# EAGLE design robot_vr (EAGLE 7.6.0)
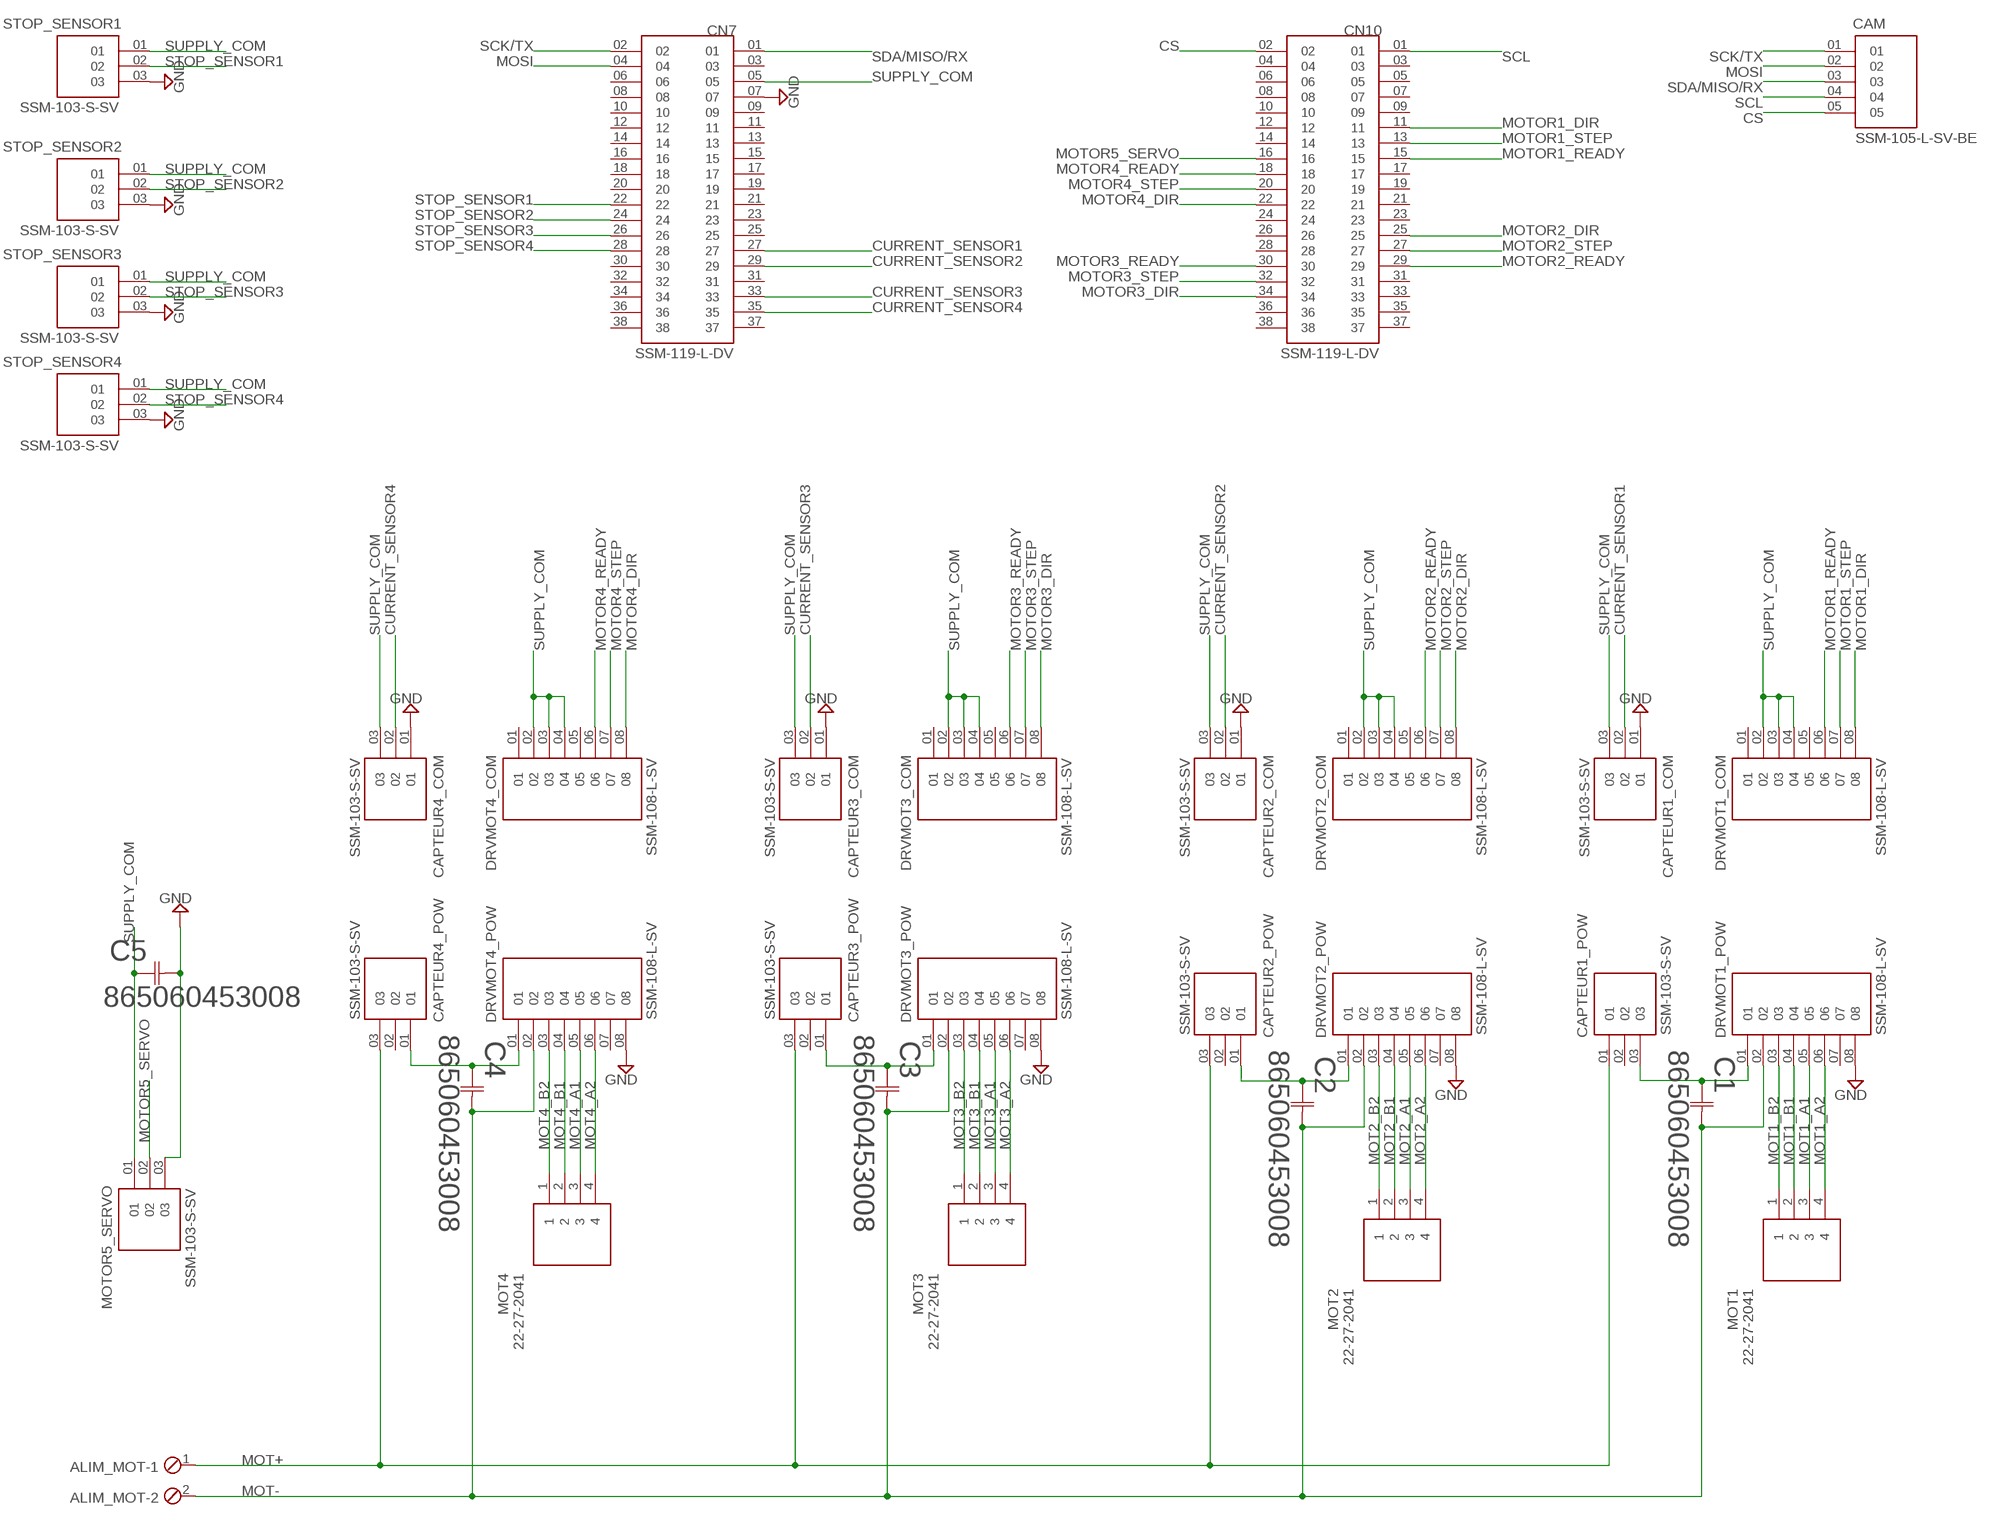
[diagram p0: schematic, sheet 1]

## Parts
ALIM_MOT  MPT2  [2POL254]
C1  865060453008  [CAP_865060453008_WRE]
C2  865060453008  [CAP_865060453008_WRE]
C3  865060453008  [CAP_865060453008_WRE]
C4  865060453008  [CAP_865060453008_WRE]
C5  865060453008  [CAP_865060453008_WRE]
CAM  SSM-105-L-SV-BE  [SAMTEC_SSM-105-L-SV-BE]
CAPTEUR1_COM  SSM-103-S-SV  [SAMTEC_SSM-103-S-SV]
CAPTEUR1_POW  SSM-103-S-SV  [SAMTEC_SSM-103-S-SV]
CAPTEUR2_COM  SSM-103-S-SV  [SAMTEC_SSM-103-S-SV]
CAPTEUR2_POW  SSM-103-S-SV  [SAMTEC_SSM-103-S-SV]
CAPTEUR3_COM  SSM-103-S-SV  [SAMTEC_SSM-103-S-SV]
CAPTEUR3_POW  SSM-103-S-SV  [SAMTEC_SSM-103-S-SV]
CAPTEUR4_COM  SSM-103-S-SV  [SAMTEC_SSM-103-S-SV]
CAPTEUR4_POW  SSM-103-S-SV  [SAMTEC_SSM-103-S-SV]
CN7  SSM-119-L-DV  [SAMTEC_SSM-119-L-DV]
CN10  SSM-119-L-DV  [SAMTEC_SSM-119-L-DV]
DRVMOT1_COM  SSM-108-L-SV  [SAMTEC_SSM-108-L-SV]
DRVMOT1_POW  SSM-108-L-SV  [SAMTEC_SSM-108-L-SV]
DRVMOT2_COM  SSM-108-L-SV  [SAMTEC_SSM-108-L-SV]
DRVMOT2_POW  SSM-108-L-SV  [SAMTEC_SSM-108-L-SV]
DRVMOT3_COM  SSM-108-L-SV  [SAMTEC_SSM-108-L-SV]
DRVMOT3_POW  SSM-108-L-SV  [SAMTEC_SSM-108-L-SV]
DRVMOT4_COM  SSM-108-L-SV  [SAMTEC_SSM-108-L-SV]
DRVMOT4_POW  SSM-108-L-SV  [SAMTEC_SSM-108-L-SV]
MOT1  22-27-2041  [HDRV4W64P254_100_4X1_1016X580H]
MOT2  22-27-2041  [HDRV4W64P254_100_4X1_1016X580H]
MOT3  22-27-2041  [HDRV4W64P254_100_4X1_1016X580H]
MOT4  22-27-2041  [HDRV4W64P254_100_4X1_1016X580H]
MOTOR5_SERVO  SSM-103-S-SV  [SAMTEC_SSM-103-S-SV]
STOP_SENSOR1  SSM-103-S-SV  [SAMTEC_SSM-103-S-SV]
STOP_SENSOR2  SSM-103-S-SV  [SAMTEC_SSM-103-S-SV]
STOP_SENSOR3  SSM-103-S-SV  [SAMTEC_SSM-103-S-SV]
STOP_SENSOR4  SSM-103-S-SV  [SAMTEC_SSM-103-S-SV]

## Nets
CAPTEUR_MOT1: C1.1 CAPTEUR1_POW.03 DRVMOT1_POW.01
CAPTEUR_MOT2: C2.1 CAPTEUR2_POW.01 DRVMOT2_POW.01
CAPTEUR_MOT3: C3.1 CAPTEUR3_POW.01 DRVMOT3_POW.01
CAPTEUR_MOT4: C4.1 CAPTEUR4_POW.01 DRVMOT4_POW.01
CS: CAM.05 CN10.02
CURRENT_SENSOR1: CAPTEUR1_COM.02 CN7.27
CURRENT_SENSOR2: CAPTEUR2_COM.02 CN7.29
CURRENT_SENSOR3: CAPTEUR3_COM.02 CN7.33
CURRENT_SENSOR4: CAPTEUR4_COM.02 CN7.35
GND: C5.2 CAPTEUR1_COM.01 CAPTEUR2_COM.01 CAPTEUR3_COM.01 CAPTEUR4_COM.01 CN7.07 DRVMOT1_POW.08 DRVMOT2_POW.08 DRVMOT3_POW.08 DRVMOT4_POW.08 MOTOR5_SERVO.03 STOP_SENSOR1.03 STOP_SENSOR2.03 STOP_SENSOR3.03 STOP_SENSOR4.03
MOSI: CAM.02 CN7.04
MOT1_A1: DRVMOT1_POW.05 MOT1.3
MOT1_A2: DRVMOT1_POW.06 MOT1.4
MOT1_B1: DRVMOT1_POW.04 MOT1.2
MOT1_B2: DRVMOT1_POW.03 MOT1.1
MOT2_A1: DRVMOT2_POW.05 MOT2.3
MOT2_A2: DRVMOT2_POW.06 MOT2.4
MOT2_B1: DRVMOT2_POW.04 MOT2.2
MOT2_B2: DRVMOT2_POW.03 MOT2.1
MOT3_A1: DRVMOT3_POW.05 MOT3.3
MOT3_A2: DRVMOT3_POW.06 MOT3.4
MOT3_B1: DRVMOT3_POW.04 MOT3.2
MOT3_B2: DRVMOT3_POW.03 MOT3.1
MOT4_A1: DRVMOT4_POW.05 MOT4.3
MOT4_A2: DRVMOT4_POW.06 MOT4.4
MOT4_B1: DRVMOT4_POW.04 MOT4.2
MOT4_B2: DRVMOT4_POW.03 MOT4.1
MOT+: ALIM_MOT.1 CAPTEUR1_POW.01 CAPTEUR2_POW.03 CAPTEUR3_POW.03 CAPTEUR4_POW.03
MOT-: ALIM_MOT.2 C1.2 C2.2 C3.2 C4.2 DRVMOT1_POW.02 DRVMOT2_POW.02 DRVMOT3_POW.02 DRVMOT4_POW.02
MOTOR1_DIR: CN10.11 DRVMOT1_COM.08
MOTOR1_READY: CN10.15 DRVMOT1_COM.06
MOTOR1_STEP: CN10.13 DRVMOT1_COM.07
MOTOR2_DIR: CN10.25 DRVMOT2_COM.08
MOTOR2_READY: CN10.29 DRVMOT2_COM.06
MOTOR2_STEP: CN10.27 DRVMOT2_COM.07
MOTOR3_DIR: CN10.34 DRVMOT3_COM.08
MOTOR3_READY: CN10.30 DRVMOT3_COM.06
MOTOR3_STEP: CN10.32 DRVMOT3_COM.07
MOTOR4_DIR: CN10.22 DRVMOT4_COM.08
MOTOR4_READY: CN10.18 DRVMOT4_COM.06
MOTOR4_STEP: CN10.20 DRVMOT4_COM.07
MOTOR5_SERVO: CN10.16 MOTOR5_SERVO.02
SCK/TX: CAM.01 CN7.02
SCL: CAM.04 CN10.01
SDA/MISO/RX: CAM.03 CN7.01
STOP_SENSOR1: CN7.22 STOP_SENSOR1.02
STOP_SENSOR2: CN7.24 STOP_SENSOR2.02
STOP_SENSOR3: CN7.26 STOP_SENSOR3.02
STOP_SENSOR4: CN7.28 STOP_SENSOR4.02
SUPPLY_COM: C5.1 CAPTEUR1_COM.03 CAPTEUR2_COM.03 CAPTEUR3_COM.03 CAPTEUR4_COM.03 CN7.05 DRVMOT1_COM.02 DRVMOT1_COM.03 DRVMOT1_COM.04 DRVMOT2_COM.02 DRVMOT2_COM.03 DRVMOT2_COM.04 DRVMOT3_COM.02 DRVMOT3_COM.03 DRVMOT3_COM.04 DRVMOT4_COM.02 DRVMOT4_COM.03 DRVMOT4_COM.04 MOTOR5_SERVO.01 STOP_SENSOR1.01 STOP_SENSOR2.01 STOP_SENSOR3.01 STOP_SENSOR4.01
Unconnected: CAPTEUR1_POW.02 CAPTEUR2_POW.02 CAPTEUR3_POW.02 CAPTEUR4_POW.02 CN7.03 CN7.06 CN7.08 CN7.09 CN7.10 CN7.11 CN7.12 CN7.13 CN7.14 CN7.15 CN7.16 CN7.17 CN7.18 CN7.19 CN7.20 CN7.21 CN7.23 CN7.25 CN7.30 CN7.31 CN7.32 CN7.34 CN7.36 CN7.37 CN7.38 CN10.03 CN10.04 CN10.05 CN10.06 CN10.07 CN10.08 CN10.09 CN10.10 CN10.12 CN10.14 CN10.17 CN10.19 CN10.21 CN10.23 CN10.24 CN10.26 CN10.28 CN10.31 CN10.33 CN10.35 CN10.36 CN10.37 CN10.38 DRVMOT1_COM.01 DRVMOT1_COM.05 DRVMOT1_POW.07 DRVMOT2_COM.01 DRVMOT2_COM.05 DRVMOT2_POW.07 DRVMOT3_COM.01 DRVMOT3_COM.05 DRVMOT3_POW.07 DRVMOT4_COM.01 DRVMOT4_COM.05 DRVMOT4_POW.07

## Library data of the parts
ALIM_MOT = con-phoenix-254:MPT2: PHOENIX CONNECTOR; OC_FARNELL: unknown; OC_NEWARK: unknown
C1-C5 = Condo-Wurth:865060453008; COPYRIGHT: Copyright (C) 2022 Ultra Librarian. All rights reserved.; MANUFACTURER_PART_NUMBER: 865060453008; MFR_NAME: Wurth Electronics
CAM = SSM-105-L-SV-BE:SSM-105-L-SV-BE: Check prices <https://pricing.snapeda.com/parts/SSM-105-L-SV-BE-TR/Samtec/view-part?ref=eda>; AVAILABILITY: In Stock; DESCRIPTION: 5 Position Receptacle, Bottom Entry Connector 0.100 (2.54mm) Surface Mount Gold; MF: Samtec; MP: SSM-105-L-SV-BE-TR; PACKAGE: None; PRICE: None; PURCHASE-URL: https://pricing.snapeda.com/search/part/SSM-105-L-SV-BE-TR/?ref=eda
CAPTEUR1_COM CAPTEUR1_POW CAPTEUR2_COM CAPTEUR2_POW CAPTEUR3_COM CAPTEUR3_POW CAPTEUR4_COM CAPTEUR4_POW MOTOR5_SERVO STOP_SENSOR1-STOP_SENSOR4 = SSM-103-S-SV:SSM-103-S-SV: Check prices <https://pricing.snapeda.com/parts/SSM-103-S-SV/Samtec/view-part?ref=eda>; AVAILABILITY: In Stock; DESCRIPTION: 3 Position Receptacle, Bottom Entry Connector 0.100 (2.54mm) Surface Mount Gold; MF: Samtec; MP: SSM-103-S-SV; PACKAGE: None; PRICE: None; PURCHASE-URL: https://pricing.snapeda.com/search/part/SSM-103-S-SV/?ref=eda
CN7 CN10 = SSM-119-L-DV:SSM-119-L-DV: Check prices <https://pricing.snapeda.com/parts/SSM-119-L-DV/Samtec%20Inc./view-part?ref=eda>; AVAILABILITY: In Stock; DESCRIPTION: 38 Position Receptacle, Pass Through Connector 0.100 (2.54mm) Surface Mount Gold; MF: Samtec Inc.; MP: SSM-119-L-DV; PACKAGE: None; PRICE: None; PURCHASE-URL: https://pricing.snapeda.com/search/part/SSM-119-L-DV/?ref=eda
DRVMOT1_COM DRVMOT1_POW DRVMOT2_COM DRVMOT2_POW DRVMOT3_COM DRVMOT3_POW DRVMOT4_COM DRVMOT4_POW = SSM-108-L-SV:SSM-108-L-SV: Check prices <https://pricing.snapeda.com/parts/SSM-108-L-SV/Samtec/view-part?ref=eda>; AVAILABILITY: In Stock; DESCRIPTION: 8 Position Receptacle, Pass Through Connector 0.100 (2.54mm) Surface Mount Gold; MF: Samtec; MP: SSM-108-L-SV; PACKAGE: None; PRICE: None; PURCHASE-URL: https://pricing.snapeda.com/search/part/SSM-108-L-SV/?ref=eda
MOT1-MOT4 = 22-27-2041:22-27-2041: Molex 22-27-2041 second source Source: Datasheet; DESCRIPTION: Molex 22-27-2041 second source; HEIGHT: mm; MANUFACTURER_NAME: Bloggs Bits; MANUFACTURER_PART_NUMBER: 22-27-2041

## Board
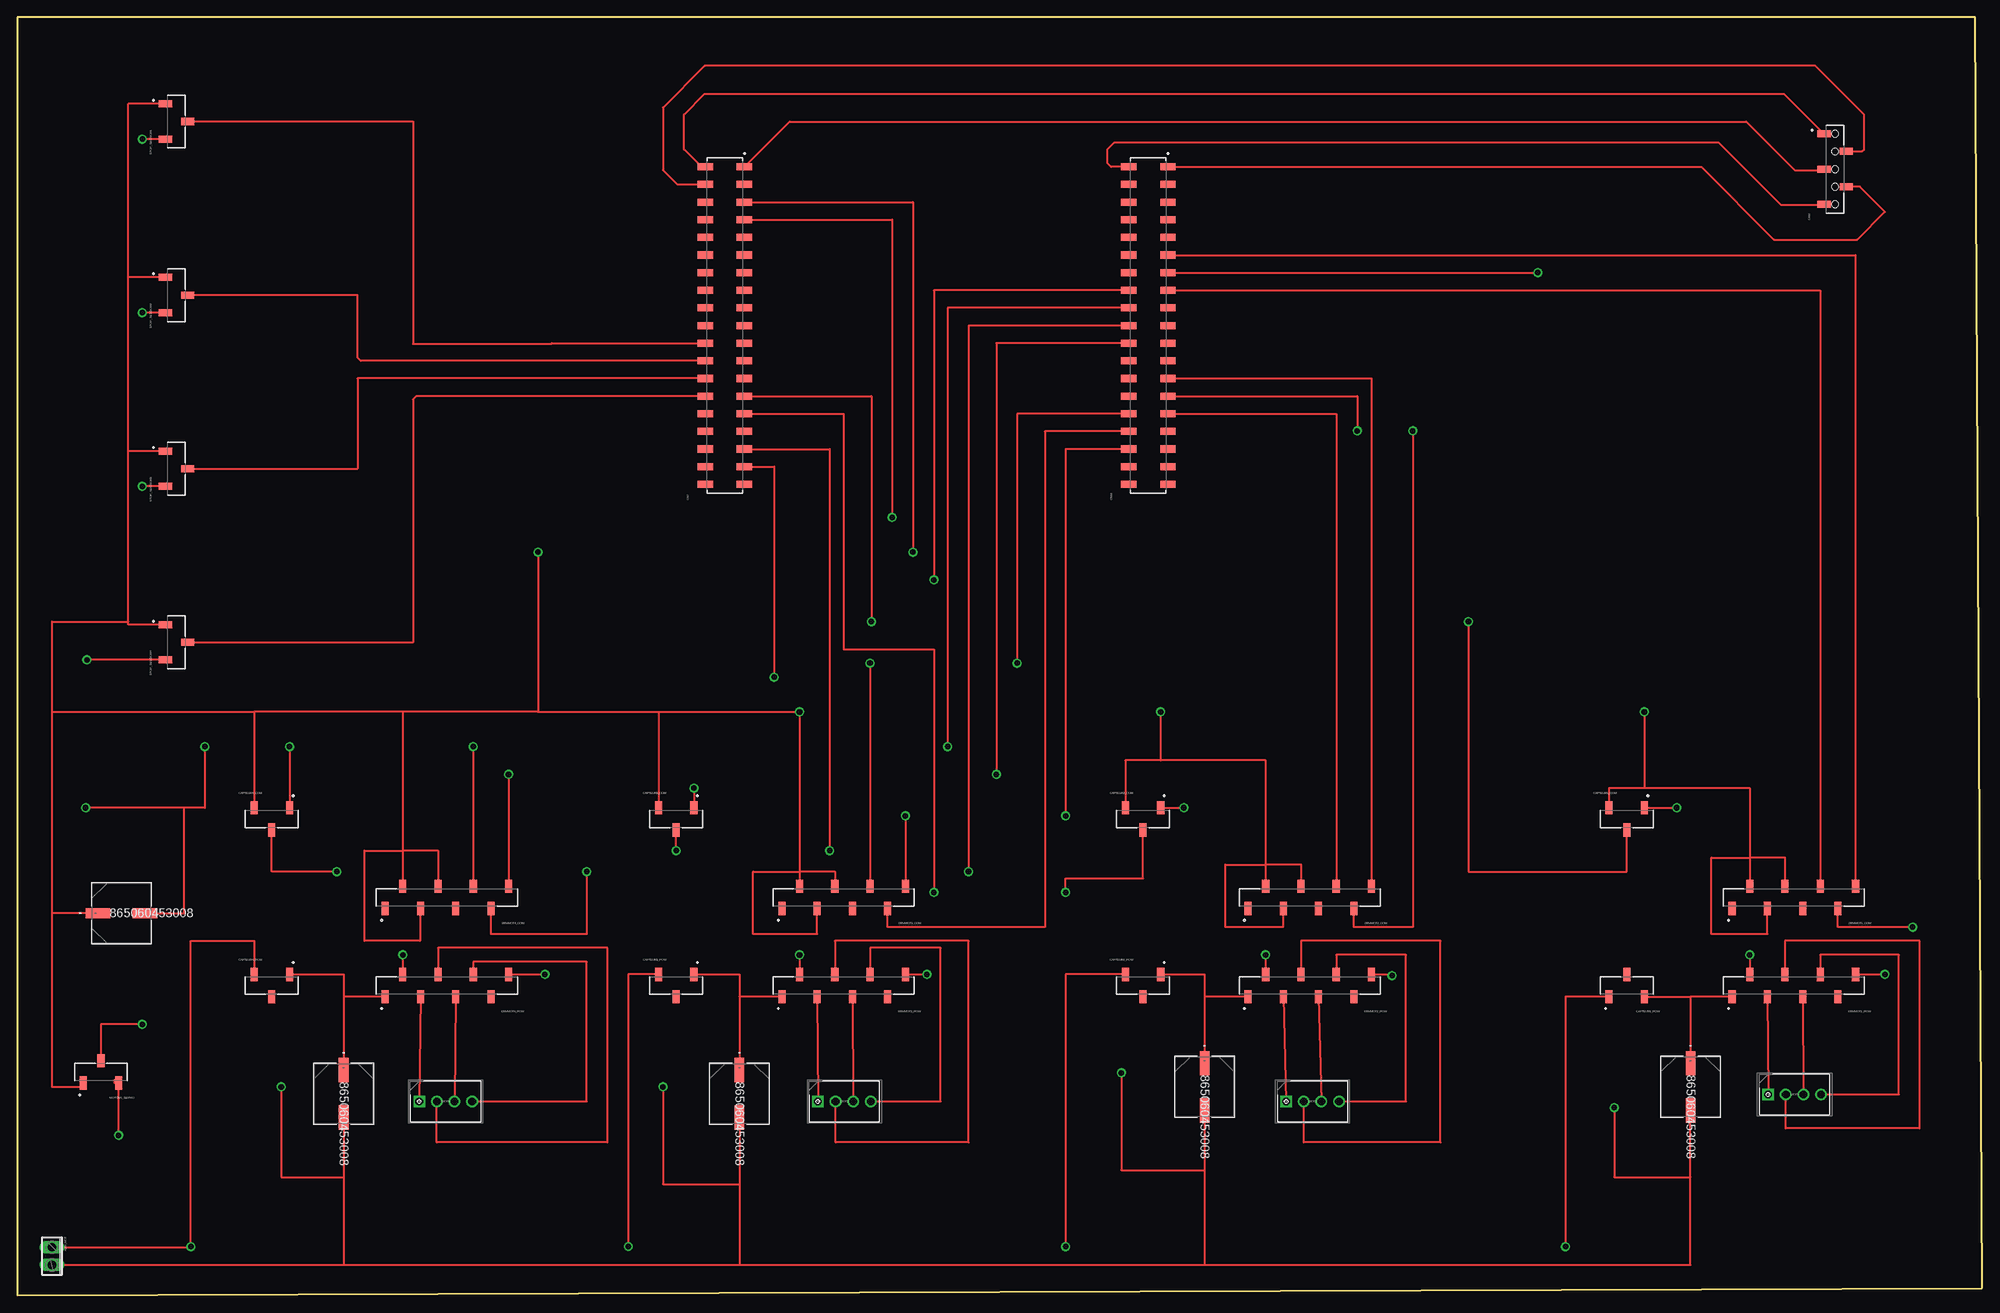
[diagram p1: board, top side]
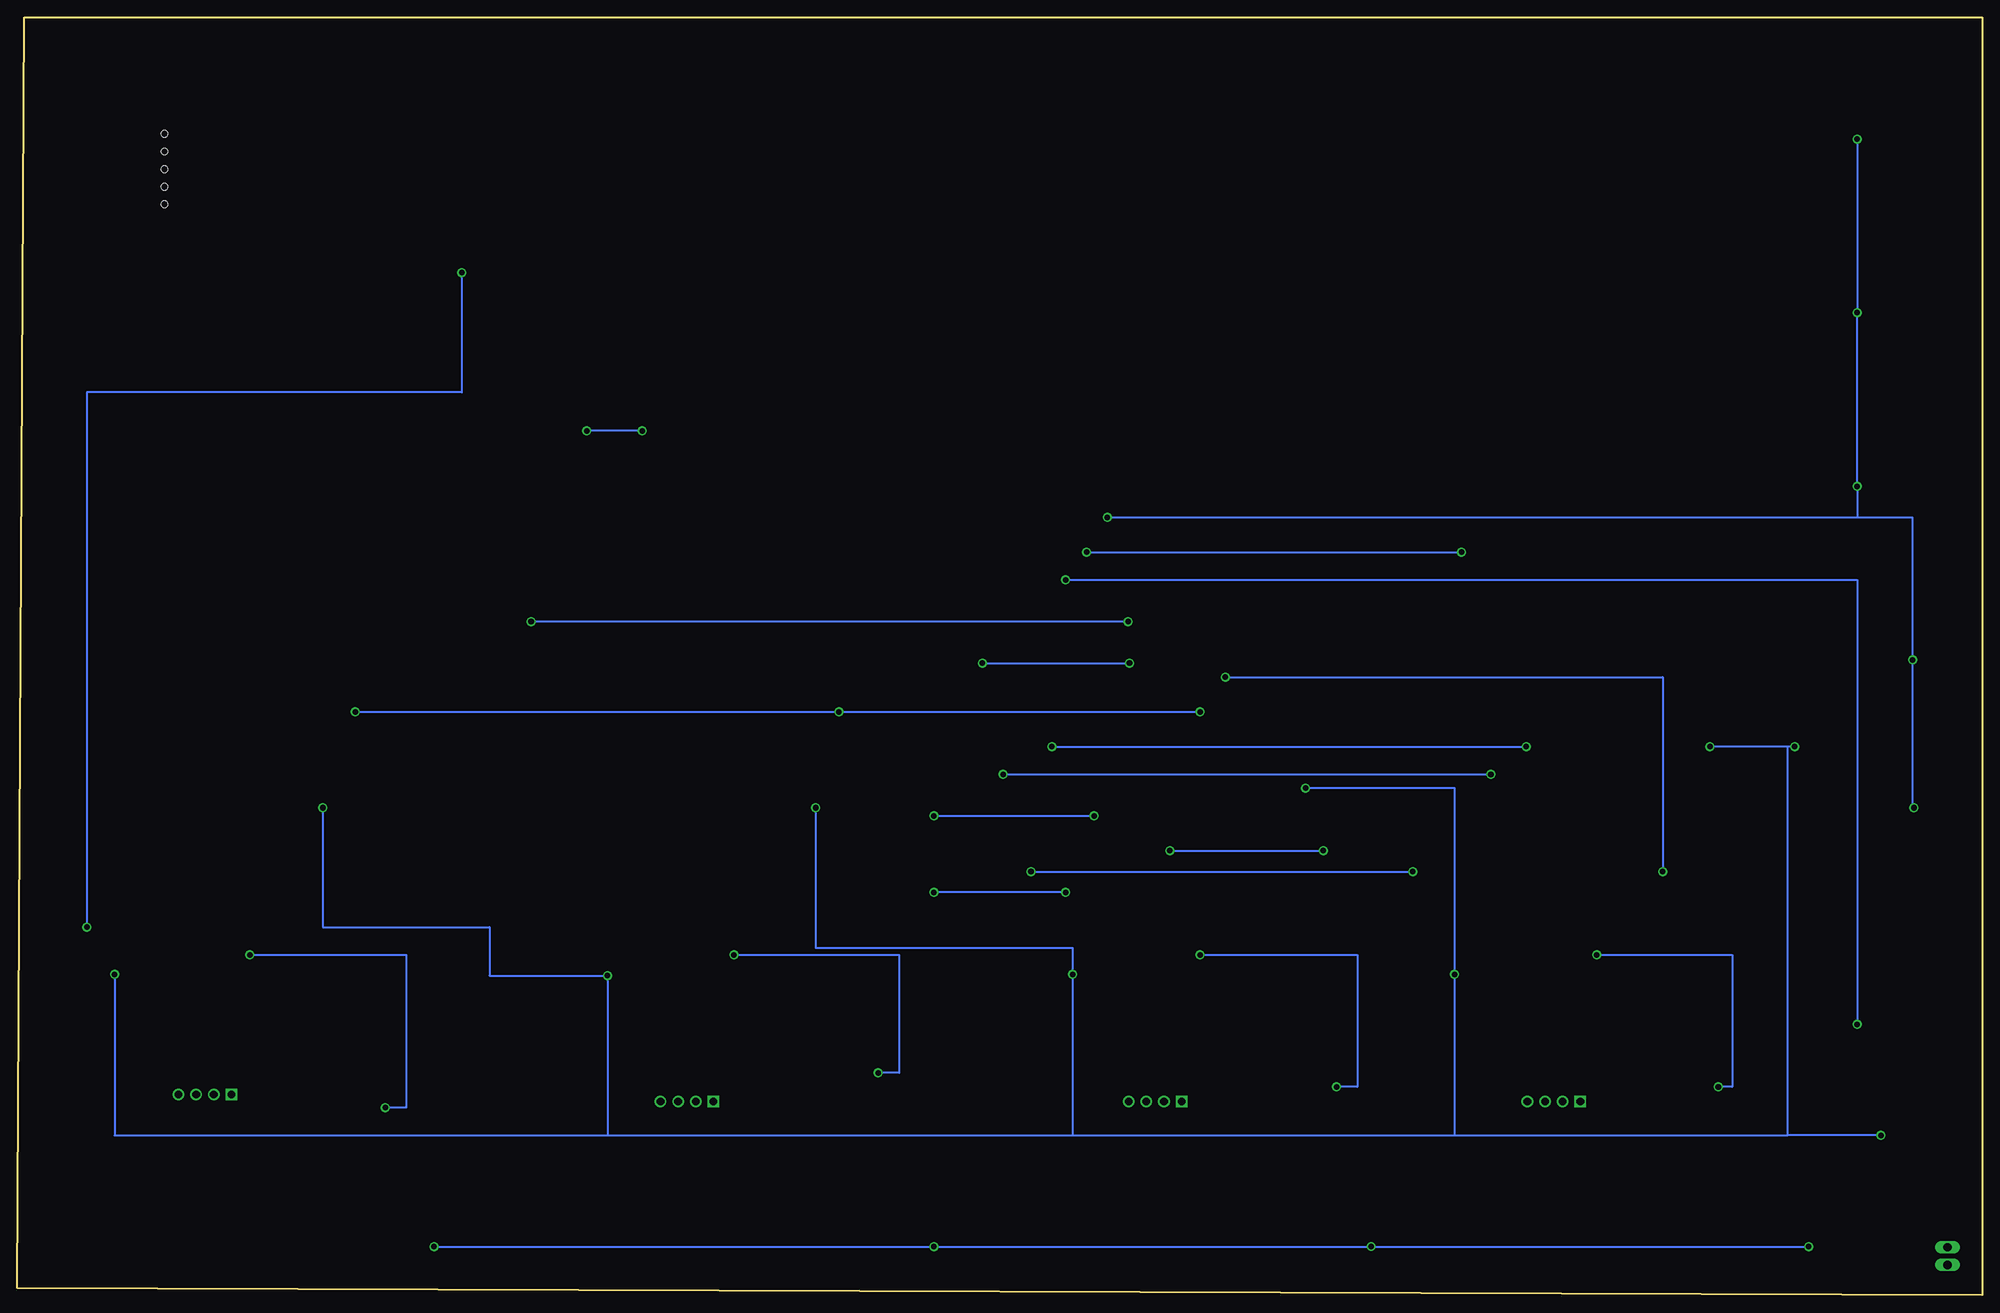
[diagram p2: board, bottom side, seen from below]

Size 283 x 184 mm. Coordinates in mm from the lower left corner, seen from the top.
Outline: 0,0 283,1 282,184 0,184 0,0
Copper layers (1*16): Top 0.035mm / dielectric 1.5mm / Bottom 0.035mm
Design rules "default *": minimum track width 10mil, minimum drill 24mil, track to track 8mil, track to pad 8mil, pad to pad 8mil, via to via 8mil, smd to smd 8mil, copper to edge 0.5mm, drill to drill 8mil, minimum pad ring 10mil, minimum via ring 8mil, stop-mask expansion 4mil, vias tented up to drill 0mil, thermal gap 0.6mm

### Footprints (pad centres in the part's own frame; a part is rotated, then mirrored left to right if it is on the bottom)
2POL254 = drill 1.2 long: 1 -1.27,0; 2 1.27,0
CAP_865060453008_WRE = smd 3.499 x 1.391: 1 -3.399,0; 2 3.399,0
SAMTEC_SSM-105-L-SV-BE = smd 1.02 x 1.905: 01 5.08,1.603; 02 2.54,-1.603; 03 0,1.603; 04 -2.54,-1.603; 05 -5.08,1.603 | hole 1.02: 5.08,0; 2.54,0; 0,0; -2.54,0; -5.08,0
SAMTEC_SSM-103-S-SV = smd 1.02 x 1.905: 01 2.54,1.603; 02 0,-1.603; 03 -2.54,1.603
SAMTEC_SSM-119-L-DV = smd 1.02 x 2.22: 01 22.86,-2.825; 02 22.86,2.825; 03 20.32,-2.825; 04 20.32,2.825; 05 17.78,-2.825; 06 17.78,2.825; 07 15.24,-2.825; 08 15.24,2.825; 09 12.7,-2.825; 10 12.7,2.825; 11 10.16,-2.825; 12 10.16,2.825; 13 7.62,-2.825; 14 7.62,2.825; 15 5.08,-2.825; 16 5.08,2.825; 17 2.54,-2.825; 18 2.54,2.825; 19 0,-2.825; 20 0,2.825; 21 -2.54,-2.825; 22 -2.54,2.825; 23 -5.08,-2.825; 24 -5.08,2.825; 25 -7.62,-2.825; 26 -7.62,2.825; 27 -10.16,-2.825; 28 -10.16,2.825; 29 -12.7,-2.825; 30 -12.7,2.825; 31 -15.24,-2.825; 32 -15.24,2.825; 33 -17.78,-2.825; 34 -17.78,2.825; 35 -20.32,-2.825; 36 -20.32,2.825; 37 -22.86,-2.825; 38 -22.86,2.825
SAMTEC_SSM-108-L-SV = smd 1.02 x 1.905: 01 8.89,1.603; 02 6.35,-1.603; 03 3.81,1.603; 04 1.27,-1.603; 05 -1.27,1.603; 06 -3.81,-1.603; 07 -6.35,1.603; 08 -8.89,-1.603
HDRV4W64P254_100_4X1_1016X580H = drill 1.11 pad 1.67 square: 1 0,0 | drill 1.11 pad 1.67: 2 2.54,0; 3 5.08,0; 4 7.62,0

### Placement (x,y rotation side)
ALIM_MOT  4.99,5.63 270 top
C1  241,30 270 top
C2  171,30 270 top
C3  104,29 270 top
C4  47,29 270 top
C5  15,55 0 top
CAM  261.82,162.15 90 top
CAPTEUR1_COM  231.8,68.58 0 top
CAPTEUR1_POW  231.8,44.58 180 top
CAPTEUR2_COM  162.14,68.58 0 top
CAPTEUR2_POW  162.14,44.58 0 top
CAPTEUR3_COM  94.9,68.58 0 top
CAPTEUR3_POW  94.9,44.58 0 top
CAPTEUR4_COM  36.66,68.58 0 top
CAPTEUR4_POW  36.66,44.58 0 top
CN7  101.9,139.62 90 top
CN10  162.9,139.62 90 top
DRVMOT1_COM  255.87,57.28 180 top
DRVMOT1_POW  255.87,44.58 180 top
DRVMOT2_COM  186.15,57.28 180 top
DRVMOT2_POW  186.15,44.58 180 top
DRVMOT3_COM  119.01,57.28 180 top
DRVMOT3_POW  119.01,44.58 180 top
DRVMOT4_COM  61.87,57.28 180 top
DRVMOT4_POW  61.87,44.58 180 top
MOT1  252.17,28.9 0 top
MOT2  182.74,27.9 0 top
MOT3  115.31,27.9 0 top
MOT4  57.88,27.9 0 top
MOTOR5_SERVO  12.04,32.15 180 top
STOP_SENSOR1  22.93,169.01 90 top
STOP_SENSOR2  22.93,144.01 90 top
STOP_SENSOR3  22.93,119.01 90 top
STOP_SENSOR4  22.93,94.01 90 top

### Tracks (layer width: path | path; a pad name or v marks a point on that pad's centre or on a via)
CAPTEUR_MOT1
  Top 0.305: CAPTEUR1_POW.03 241,42.98 | 241,42.98 C1.1 | DRVMOT1_POW.01 241,42.98
CAPTEUR_MOT2
  Top 0.305: CAPTEUR2_POW.01 171,46.18 171,43 171,42.98 | 171,42.98 C2.1 | DRVMOT2_POW.01 171,42.98
CAPTEUR_MOT3
  Top 0.305: CAPTEUR3_POW.01 104,46.18 104,43 104,42.98 | 104,42.98 C3.1 | DRVMOT3_POW.01 104,42.98
CAPTEUR_MOT4
  Top 0.305: CAPTEUR4_POW.01 47,46.18 47,43 47,42.98 | 47,42.98 C4.1 | DRVMOT4_POW.01 47,42.98
CS
  Top 0.305: CN10.02 157.52,162.48 157,163 157,165 158,166 245,166 254,157 260.15,157 CAM.05
CURRENT_SENSOR1  (via drill 0.8 pad 1.3)
  Top 0.305: CN7.27 123,129.46 v123,97 | v209,97 209,61 231.8,61 CAPTEUR1_COM.02
  Bottom 0.305: v123,97 v209,97
CURRENT_SENSOR2  (via drill 0.8 pad 1.3)
  Top 0.305: CN7.29 119,126.92 119,93 132,93 v132,58 | v151,58 151,60 162.14,60 CAPTEUR2_COM.02
  Bottom 0.305: v132,58 v151,58
CURRENT_SENSOR3  (via drill 0.8 pad 1.3)
  Top 0.305: CN7.33 117,121.84 v117,64 | v94.9,64 CAPTEUR3_COM.02
  Bottom 0.305: v117,64 v94.9,64
CURRENT_SENSOR4  (via drill 0.8 pad 1.3)
  Top 0.305: CN7.35 109,119.3 v109,89 | v46,61 36.66,61 CAPTEUR4_COM.02
  Bottom 0.305: v109,89 46,89 v46,61
GND  (via drill 0.8 pad 1.3)
  Top 0.305: STOP_SENSOR1.03 v18,166.47 | STOP_SENSOR2.03 v18,141.47 | STOP_SENSOR3.03 v18,116.47 | STOP_SENSOR4.03 v10,91.47 | 24,70.18 27,70.18 v27,79 | 24,70.18 v9.83,70.18 10,70.18 | CN7.07 126,154.86 v126,112 | DRVMOT4_POW.08 v76,46.18 | DRVMOT3_POW.08 v131,46.18 131,46 | DRVMOT2_POW.08 198,46.18 v198,46 | DRVMOT1_POW.08 v269,46.18 | v39.2,79 CAPTEUR4_COM.01 | v97.44,73 CAPTEUR3_COM.01 | CAPTEUR2_COM.01 v168,70.18 | CAPTEUR1_COM.01 v239,70.18 | C5.2 24,55 24,70.18 | 14,31 14,30.55 MOTOR5_SERVO.03 v14.58,23
  Bottom 0.254: v18,116.47 18,112 | v27,79 28,79 v39.2,79
  Bottom 0.305: v18,166.47 v18,141.47 v18,116.47 | v9.83,70.18 10,70.18 v10,91.47 10,112 18,112 v126,112 | 76,23 v76,46.18 76,73 v97.44,73 | 76,23 28,23 | 28,23 28,79 | 131,23 v131,46.18 131,50 168,50 v168,70.18 | 131,23 76,23 | 198,23 v198,46 215,46 215,53 239,53 v239,70.18 | 198,23 131,23 | v269,46.18 269,23 198,23 | v14.58,23 28,23
  cutout Bottom: 1,183 280,183 280,2 1,2 1,8
MOSI
  Top 0.305: CN7.04 99.08,160 95,160 93,162 93,171 99,177 259,177 266,170 266,165 265.69,164.69 CAM.02
MOT1_A1
  Top 0.305: DRVMOT1_POW.05 MOT1.3
MOT1_A2
  Top 0.305: MOT1.4 271,28.9 271,49 259.68,49 DRVMOT1_POW.06
MOT1_B1
  Top 0.305: DRVMOT1_POW.04 254.6,51 274,51 274,24 254.71,24 MOT1.2 255,28.9
MOT1_B2
  Top 0.305: DRVMOT1_POW.03 MOT1.1
MOT2_A1
  Top 0.305: DRVMOT2_POW.05 MOT2.3
MOT2_A2
  Top 0.305: MOT2.4 200,27.9 200,49 189.96,49 DRVMOT2_POW.06
MOT2_B1
  Top 0.305: DRVMOT2_POW.04 184.88,51 205,51 205,22 185.28,22 MOT2.2
MOT2_B2
  Top 0.305: DRVMOT2_POW.03 MOT2.1
MOT3_A1
  Top 0.305: DRVMOT3_POW.05 MOT3.3
MOT3_A2
  Top 0.305: MOT3.4 133,27.9 133,50 122.82,50 DRVMOT3_POW.06
MOT3_B1
  Top 0.305: DRVMOT3_POW.04 117.74,51 137,51 137,22 117.85,22 MOT3.2
MOT3_B2
  Top 0.305: DRVMOT3_POW.03 MOT3.1
MOT4_A1
  Top 0.305: DRVMOT4_POW.05 MOT4.3
MOT4_A2
  Top 0.305: MOT4.4 82,27.9 82,48 65.68,48 DRVMOT4_POW.06
MOT4_B1
  Top 0.305: DRVMOT4_POW.04 60.6,50 85,50 85,22 60.42,22 MOT4.2
MOT4_B2
  Top 0.305: DRVMOT4_POW.03 MOT4.1
MOT+  (via drill 0.8 pad 1.27, 0.8 pad 1.3)
  Top 0.305: ALIM_MOT.1 25,6.9 v25,7 25,51 34.12,51 CAPTEUR4_POW.03 | CAPTEUR3_POW.03 88,46.18 v88,7 | CAPTEUR2_POW.03 151,46.18 v151,7 | CAPTEUR1_POW.01 223,42.98 v223,7
  Bottom 0.305: v25,7 v88,7 v151,7 v223,7
MOT-  (via drill 0.8 pad 1.3)
  Top 0.305: ALIM_MOT.2 47,4.36 | 47,4.36 104,4.36 | 104,4.36 171,4.36 | 171,4.36 241,4.36 241,17 | C4.2 47,17 | 47,17 47,4.36 | v55.52,49 DRVMOT4_POW.02 | C3.2 104,16 | 104,16 104,4.36 | v112.66,49 DRVMOT3_POW.02 | C2.2 171,18 | 171,18 171,4.36 | 241,17 C1.2 | v249.52,49 DRVMOT1_POW.02 | v38,30 38,17 47,17 | v93,30 93,16 104,16 | v159,32 159,18 171,18 | v179.8,49 DRVMOT2_POW.02 | v230,27 230,17 241,17
  Bottom 0.305: v55.52,49 36,49 36,30 v38,30 | v112.66,49 90,49 90,30 v93,30 | v179.8,49 156,49 156,32 v159,32 | v249.52,49 227,49 227,27 v230,27
MOTOR1_DIR
  Top 0.305: CN10.11 264.76,149.78 DRVMOT1_COM.08
MOTOR1_READY
  Top 0.305: CN10.15 259.68,144.7 DRVMOT1_COM.06
MOTOR1_STEP  (via drill 0.8 pad 1.3)
  Top 0.305: v273,53 262.22,53 DRVMOT1_COM.07 | CN10.13 v219,147.24
  Bottom 0.305: v273,53 273,130 219,130 v219,147.24
MOTOR2_DIR
  Top 0.305: CN10.25 195.04,132 DRVMOT2_COM.08
MOTOR2_READY
  Top 0.305: CN10.29 189.96,126.92 DRVMOT2_COM.06
MOTOR2_STEP  (via drill 0.8 pad 1.3)
  Top 0.305: v201,124.46 201,53 192.5,53 DRVMOT2_COM.07 | CN10.27 193,129.46 v193,124.46
  Bottom 0.305: v193,124.46 v201,124.46
MOTOR3_DIR  (via drill 0.8 pad 1.3)
  Top 0.305: CN10.34 151,121.84 v151,69 | v127.9,69 DRVMOT3_COM.08
  Bottom 0.305: v151,69 v127.9,69
MOTOR3_READY  (via drill 0.8 pad 1.3)
  Top 0.305: CN10.30 144,126.92 v144,91 | v122.82,91 DRVMOT3_COM.06
  Bottom 0.305: v144,91 v122.82,91
MOTOR3_STEP
  Top 0.305: CN10.32 148,124.38 148,53 125.36,53 DRVMOT3_COM.07
MOTOR4_DIR  (via drill 0.8 pad 1.3)
  Top 0.305: CN10.22 141,137.08 v141,75 | v70.76,75 DRVMOT4_COM.08
  Bottom 0.305: v141,75 v70.76,75
MOTOR4_READY  (via drill 0.8 pad 1.3)
  Top 0.305: CN10.18 134,142.16 v134,79 | v65.68,79 DRVMOT4_COM.06
  Bottom 0.305: v134,79 v65.68,79
MOTOR4_STEP  (via drill 0.8 pad 1.3)
  Top 0.305: CN10.20 137,139.62 v137,61 | v82,61 82,52 68.22,52 DRVMOT4_COM.07
  Bottom 0.305: v137,61 v82,61
MOTOR5_SERVO  (via drill 0.8 pad 1.3)
  Top 0.305: CN10.16 132,144.7 v132,103 | v18,39 12.04,39 MOTOR5_SERVO.02
  Bottom 0.305: v132,103 18,103 v18,39
SCK/TX
  Top 0.305: CN7.02 98.52,162.48 96,165 96,170 99,173 254.45,173 CAM.01
SCL
  Top 0.305: CN10.01 242.52,162.48 253,152 265,152 269,156 265.39,159.61 CAM.04
SDA/MISO/RX
  Top 0.305: CN7.01 111.25,169 249,169 256,162 260.66,162 260.51,162.15 CAM.03
STOP_SENSOR1
  Top 0.305: STOP_SENSOR1.02 57,169.01 57,137 76.92,137 77,137.08 CN7.22
STOP_SENSOR2
  Top 0.305: STOP_SENSOR2.02 49,144.01 49,135 49.46,134.54 CN7.24
STOP_SENSOR3
  Top 0.305: STOP_SENSOR3.02 49,119.01 49,132 CN7.26
STOP_SENSOR4
  Top 0.305: STOP_SENSOR4.02 57,94.01 57,129 57.46,129.46 CN7.28
SUPPLY_COM  (via drill 0.8 pad 1.3)
  Top 0.254: 5,94 5,97 16,97
  Top 0.305: CN7.05 129,157.4 v129,107 | STOP_SENSOR1.01 16,171.55 16,146.55 | STOP_SENSOR2.01 16,146.55 | STOP_SENSOR3.01 16,121.55 | 16,121.55 16,146.55 | STOP_SENSOR4.01 16,96.55 16,97 16,121.55 | v75,107 75,84 | 55.52,84 34.12,84 | 55.52,84 55.52,64 | 55.52,64 DRVMOT4_COM.02 | 75,84 55.52,84 | 75,84 92.36,84 | 92.36,84 v112.66,84 112.66,61 | 5,55 5,30 9.5,30 MOTOR5_SERVO.01 | 5,55 5,84 | 5,84 34.12,84 | 112.66,61 DRVMOT3_COM.02 | DRVMOT4_COM.03 58,55.68 58,51 50,51 50,64 55.52,64 | 112.66,61 106,61 106,52 115.2,52 DRVMOT3_COM.03 | 55.52,64 60.6,64 DRVMOT4_COM.04 | 112.66,61 117.74,61 DRVMOT3_COM.04 | v164.68,84 164.68,77 | 164.68,77 179.8,77 179.8,62 | 179.8,62 DRVMOT2_COM.02 | 179.8,62 174,62 174,53 182.34,53 DRVMOT2_COM.03 | 179.8,62 184.88,62 DRVMOT2_COM.04 | v234.34,84 234.34,73 | 234.34,73 249.52,73 249.52,63 | 249.52,63 DRVMOT1_COM.02 | 249.52,63 244,63 244,52 252.06,52 DRVMOT1_COM.03 | 249.52,63 254.6,63 DRVMOT1_COM.04 | 5,84 5,94 | 34.12,84 CAPTEUR4_COM.03 | 92.36,84 CAPTEUR3_COM.03 | 164.68,77 159.6,77 CAPTEUR2_COM.03 | 234.34,73 229.26,73 CAPTEUR1_COM.03 | C5.1 5,55
  Bottom 0.305: v129,107 v75,107 | v112.66,84 v164.68,84 v234.34,84